# Altium project XXXX.468361.001.PrjPCB
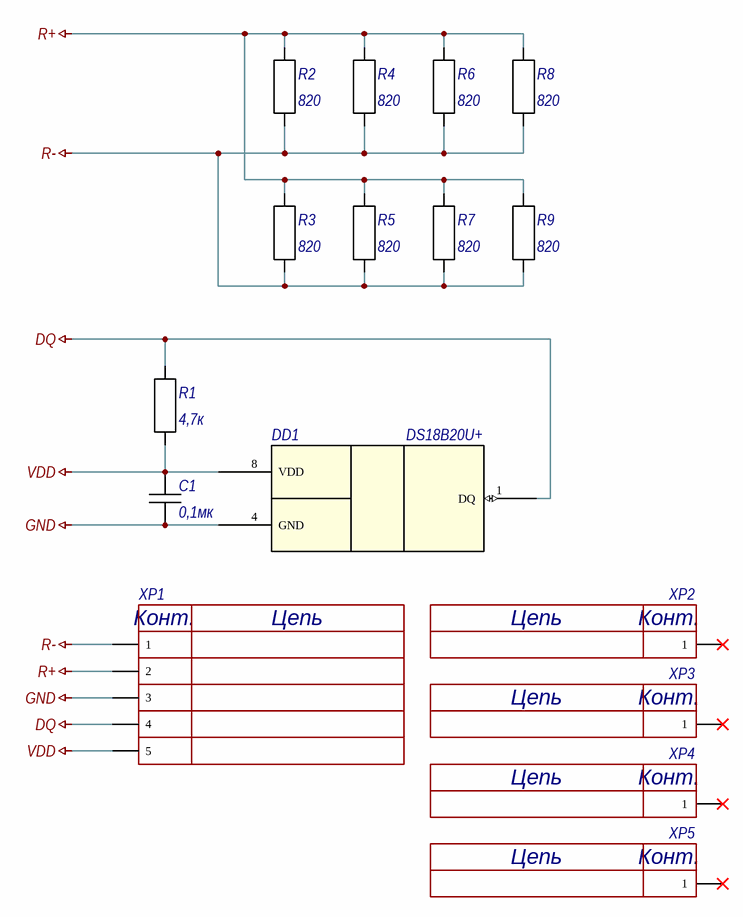
[diagram p0: XXXX.468361.001.SchDoc]
Âèä_äîêóìåíòà: Ôàéë ïðîåêòà ïå÷àòíîé ïëàòû; Âèä_äîêóìåíòà_PCB: Ôàéë ïå÷àòíîé ïëàòû; Âèä_äîêóìåíòà_SCH: Ñõåìà ýëåêòðè÷åñêàÿ ïðèíöèïèàëüíàÿ; Дата_изменения: 23.04.2018; Дата_изменения_ВП: 25.04.2018; Дата_изменения_ПЭ3: 24.04.2018; Дата_изменения_СП: 26.04.2018; Äîêóìåíòàöèÿ0: À3#ÕÕÕÕ.468361.001#Ñáîðî÷íûé ÷åðòåæ#ÑÁ##1; Äîêóìåíòàöèÿ1: À3#ÕÕÕÕ.468361.001#Ñõåìà ýëåêòðè÷åñêàÿ ïðèíöèïèàëüíàÿ#Ý3##1; Äîêóìåíòàöèÿ2: À4#ÕÕÕÕ.468361.001#Ïåðå÷åíü ýëåìåíòîâ#ÏÝ3##1; Êîä_äîêóìåíòà: Ò6Ì; Êîä_äîêóìåíòà_PCB: Ò5Ì; Êîä_äîêóìåíòà_SCH: Ý3; Ëèòåðà: Ï; Ëèòåðà2: Ý; Ëèòåðà3: Ò; Ìàòåðèàëû0: Ïðèïîé ÏÎÑ-61 ÃÎÑÒ 21931-76#1#ã##1#1#1; Ìàòåðèàëû1: Ëàê ÓÐ-231 ÒÓ6-10-863-76.9.3#0,1#ë##1#1#1; Íàèìåíîâàíèå: Ìîäóëü îáîãðåâà (ÌÎ); Íàèìåíîâàíèå1: Ìîäóëü îáîãðåâà (ÌÎ); Íàèìåíîâàíèå_PCB: Ïëàòà ïå÷àòíàÿ; Номер_документа_изменение: 001-18; Номер_документа_изменение_ВП: 003-18; Номер_документа_изменение_ПЭ3: 002-18; Номер_документа_изменение_СП: 004-18; Îáîçíà÷åíèå: ÕÕÕÕ.468361.001; Обозначение_PCB: XXXX.758723.001; Обозначение_SCH: Ñõåìà ýëåêòðè÷åñêàÿ ïðèíöèïèàëüíàÿ; Îáîçíà÷åíèå_Êîä: ÕÕÕÕ.468361.001Ý3; Ïåðâ.Ïðèìåí.: ÕÕÕÕ.468361.777; ÏåðâÏðèìåí: ÕÕÕÕ.468361.777; Порядковый_номер_изменения: 1; Порядковый_номер_изменения_ВП: 3; Порядковый_номер_изменения_ПЭ3: 2; Порядковый_номер_изменения_СП: 4; Ïðîåêò: Ïðîåêò, Èçäåëèå, Áëîê, ÔÓ; Ðàçäåë: Äîêóìåíòàöèÿ; Ðàçäåë_PCB: Äîêóìåíòàöèÿ; Ðàçäåë_SCH: Äîêóìåíòàöèÿ; Óêàçàíèÿ_èçìåíåíèå: Çàì.; Óêàçàíèÿ_èçìåíåíèå_ÂÏ: Âñå; Óêàçàíèÿ_èçìåíåíèå_ÏÝ3: Íîâ.; Указания_изменение_СП: -; Ôîðìàò_PCB: À3; Õàðàêòåð_ðàáîòû: Ðóê.Ïðîåêòà; Шифр_PCB: alb_modo; ï_Äîï_ãðàôà: Ê_ÐÏðîåêòà; ï_Äîï_ãðàôà_Ð: Ñõ_ÐÏðîåêòà; ï_Í_êîíòð: Ê_ÍÊîíòð.; ï_Í_êîíòð_Ð: Ñõ_ÍÊîíòð.; ï_Ïðîâ: Ê_Ïðîâ.; ï_Ïðîâ_Ð: Ñõ_Ïðîâ.; ï_Ðàçðàá: Ê_Ðàçðàá.; ï_Ðàçðàá_Ð: Ñõ_Ðàçðàá; ï_Ò_Êîíòð: Ê_ÒÊîíòð.; ï_Óòâ: Ê_Óòâ.; ï_Óòâ_Ð: Ñõ_Óòâ.
1 sheet, 16 parts. Net scope: global (net labels, ports and power ports of the same name join across sheets).
Board file: XXXX.758723.001.PcbDoc

## Sheet XXXX.468361.001.SchDoc: Модуль обогрева двигателя объектива (МОДО)
size 209 x 297 mm; ApprovedBy: Кондтатьев; CheckedBy: Быстров; DrawnBy: Федотов; DocumentNumber: ИЮТВ.468361.039Э3; SheetTotal: 1; StandartControlBy: Смирнова; Letter1: О; Letter2: О1; DocumentType: Схема электрическая принципиальная; Title1: Модуль обогрева двигателя; Title2: объектива (МОДО); Str1_1Number: -; Str1_2Action: Нов.; Str1_3Journal: ИЮТВ.1557-15; GroupName: “ГОЭС “Альбатрос” (-03), БОЭ, МОЭ-4, КТВ; GroupNumber: ИЮТВ.468361.039; PageSetup: Record=PageOptions|CenterHorizontal=True|CenterVertical=True|PrintScale=0.67|XCorrection=1.00|YCorrection=1.00|PrintKind=2|BorderSize=5000000|LeftOffset=0|BottomOffset=0|Orientation=2|PaperLength=1000|PaperWidth=1000|Scale=100|PaperSource=7|PrintQuality=-3|MediaType=1|DitherType=10|PrintScaleMode=1|PaperKind=A4|PaperIndex=9

### Parts
C1  ValueSCH: 0,1мк  [CAPC1608X90N]  (hidden comment: GRM 0603 0,1 мкФ ±10% 50В X7R)
DD1  DS18B20U+  [SOP65P490X110-8CN]
R1  ValueSCH: 4,7к  [RESC1005X40N]  (hidden comment: CR 0402 4,7 кОм ±1%)
R2  ValueSCH: 820  [RESC6331X75N]  (hidden comment: CR 2512 820 Ом ±1%)
R3  ValueSCH: 820  [RESC6331X75N]  (hidden comment: CR 2512 820 Ом ±1%)
R4  ValueSCH: 820  [RESC6331X75N]  (hidden comment: CR 2512 820 Ом ±1%)
R5  ValueSCH: 820  [RESC6331X75N]  (hidden comment: CR 2512 820 Ом ±1%)
R6  ValueSCH: 820  [RESC6331X75N]  (hidden comment: CR 2512 820 Ом ±1%)
R7  ValueSCH: 820  [RESC6331X75N]  (hidden comment: CR 2512 820 Ом ±1%)
R8  ValueSCH: 820  [RESC6331X75N]  (hidden comment: CR 2512 820 Ом ±1%)
R9  ValueSCH: 820  [RESC6331X75N]  (hidden comment: CR 2512 820 Ом ±1%)
XP1  СНП346-5ВП21-1-В  [ELECTRODETAL_SNP346-5VP21-1]  (value not drawn)
XP2  Лепесток 2-1-2-7-02 ГОСТ 16840-78  [ELPetalPin_2-1-2-7-02GOST_16840]  (value not drawn)
XP3  Лепесток 2-1-2-7-02 ГОСТ 16840-78  [ELPetalPin_2-1-2-7-02GOST_16840]  (value not drawn)
XP4  Лепесток 2-1-2-7-02 ГОСТ 16840-78  [ELPetalPin_2-1-2-7-02GOST_16840]  (value not drawn)
XP5  Лепесток 2-1-2-7-02 ГОСТ 16840-78  [ELPetalPin_2-1-2-7-02GOST_16840]  (value not drawn)

### Nets
DQ: DD1.1(DQ) R1.1 XP1.4
GND: C1.2 DD1.4(GND) XP1.3
R+: R2.1 R3.1 R4.1 R5.1 R6.1 R7.1 R8.1 R9.1 XP1.2
R-: R2.2 R3.2 R4.2 R5.2 R6.2 R7.2 R8.2 R9.2 XP1.1
VDD: C1.1 DD1.8(VDD) R1.2 XP1.5

Not connected (* = marked no-connect by the designer): DD1 2(NC) 3(NC) 5(NC) 6(NC) 7(NC); XP2 1*; XP3 1*; XP4 1*; XP5 1*

### Notes on the sheet
- Перв. примен.
- Справ. №
- Подп. дата
- Инв. № дубл.
- Взам. инв. №
- Подп. и дата
- Изм.
- Разраб.
- Лист
- № докум.
- Подп.
- Дата
- Лит.
- Масса
- Масштаб
- Пров.
- Т.контр.
- Листов
- Инв. № подл.
- Н.контр.
- Утв.
- Файл:
- Копировал
- Формат А4
- (in symbol Лепесток 2-1-2-7-02 ГОСТ 16840-78) Цепь; Конт.
- (in symbol СНП346-5ВП21-1-В РЮМК.430420.011ТУ) Конт.; Цепь

### Library data of the parts
C1 = GRM188R71H104KA93#: Non-polarised capacitor; Manufacturer: MURATA; ManufacturerCountry: США; Analog: (null); Group: C; PCB_Layout: SMT; Наименование: Конденсатор; Раздел: Прочие изделия; Part Number: GRM188R71H104KA93#; Name: GRM 0603 0,1 мкФ ±10% 50В X7R; ComponentLink1Description: Manufacturer Link; ComponentLink1URL: www.murata.com; ComponentLink2Description: Datasheet Link; ComponentLink2URL: http://www.murata.com/products/catalog/pdf/c02e.pdf; Pin Count: 2; Status: Разрешен; Обозначение: (null)
DD1 = DS18B20U+: Programmable Resolution 1-Wire Digital Thermometer; Group: DD; Раздел: Прочие изделия; Наименование: Микросхема; Analog: (null); PCB_Layout: SMT; Part Number: DS18B20U+; Name: DS18B20U+; ComponentLink1Description: Manufacturer Link; ComponentLink1URL: www.maximintegrated.com; ComponentLink2Description: Datasheet Link; ComponentLink2URL: http://datasheets.maximintegrated.com/en/ds/DS18B20.pdf; Status: Разрешен; Pin Count: 8; ValueSCH: (null); Обозначение: (null)
R1 = CR0402-FX-4701G: Manufacturer: Bourns; ManufacturerCountry: США; Analog: (null); Group: R; PCB_Layout: SMT; Наименование: Резистор; Раздел: Прочие изделия; Part Number: CR0402-FX-4701G; Name: CR 0402 4,7 кОм ±1%; ComponentLink1Description: Manufacturer Link; ComponentLink1URL: www.bourns.com; ComponentLink2Description: Datasheet Link; ComponentLink2URL: http://www.bourns.com/data/global/pdfs/CR0402.pdf; Pin Count: 2; Status: Разрешен; Обозначение: (null)
R2-R9 = CR2512-FX-8200E: Manufacturer: Bourns; ManufacturerCountry: США; Analog: (null); Group: R; PCB_Layout: SMT; Наименование: Резистор; Раздел: Прочие изделия; Part Number: CR2512-FX-8200E; Name: CR 2512 820 Ом ±1%; ComponentLink1Description: Manufacturer Link; ComponentLink1URL: www.bourns.com; ComponentLink2Description: Datasheet Link; ComponentLink2URL: http://www.bourns.com/data/global/pdfs/CR2010.pdf; Pin Count: 2; Status: Разрешен; Обозначение: (null)
XP1 = СНП346-5ВП21-1-В РЮМК.430420.011ТУ: Connector 1 pin male - 1 parts; Manufacturer: АО «Карачевский завод «Электродеталь»; ManufacturerCountry: Россия; Group: XP; Раздел: Прочие изделия; Обозначение: (null); Наименование: Соединитель; Analog: PLS; ValueSCH: 1.0А, 125В; PCB_Layout: PTH; ProductCode: 27.33.13.120; ComponentLink1Description: Manufacturer Link; ComponentLink1URL: https://www.elektrodetal.com/; ComponentLink2Description: Datasheet Link; Part Number: СНП346-5ВП21-1-В РЮМК.430420.011ТУ; Status: Разрешен; Name: СНП346-5ВП21-1-В; Pin Count: 1; ComponentLink2URL: http://www.elektrodetal.com/sites/default/files/downloads/snp346.pdf; GOST TU: РЮМК.430420.011ТУ; StandartDoc: РЮМК.430420.011ТУ
XP2-XP5 = Лепесток 2-1-2-7-02 ГОСТ 16840-78: Connector 1 pin male - 1 parts; ManufacturerCountry: Россия; Group: XP; Раздел: Стандартные изделия; Обозначение: (null); Наименование: Соединитель; ValueSCH: 1.0А, 125В; PCB_Layout: PTH; ProductCode: 27.33.13.120; ComponentLink1Description: Manufacturer Link; ComponentLink1URL: http://docs.cntd.ru/document/1200044394; ComponentLink2Description: Datasheet Link; Part Number: Лепесток 2-1-2-7-02 ГОСТ 16840-78; Status: Разрешен; Name: Лепесток 2-1-2-7-02 ГОСТ 16840-78; Pin Count: 1; ComponentLink2URL: http://docs.cntd.ru/document/1200044394; GOST TU: ГОСТ 16840-78; StandartDoc: ГОСТ 16840-78

## Assembly variants
-00: all parts fitted
-01: not fitted R2 R9 XP2 XP3 XP4 XP5; alternate parts XP1 -> СНП346-5ВП31-1-В РЮМК.430420.011ТУ
-02: alternate parts R2 -> CR2512-FX-8201E, R9 -> CR2512-FX-8201E